# EAGLE design shutter_control (EAGLE 7.3.0)
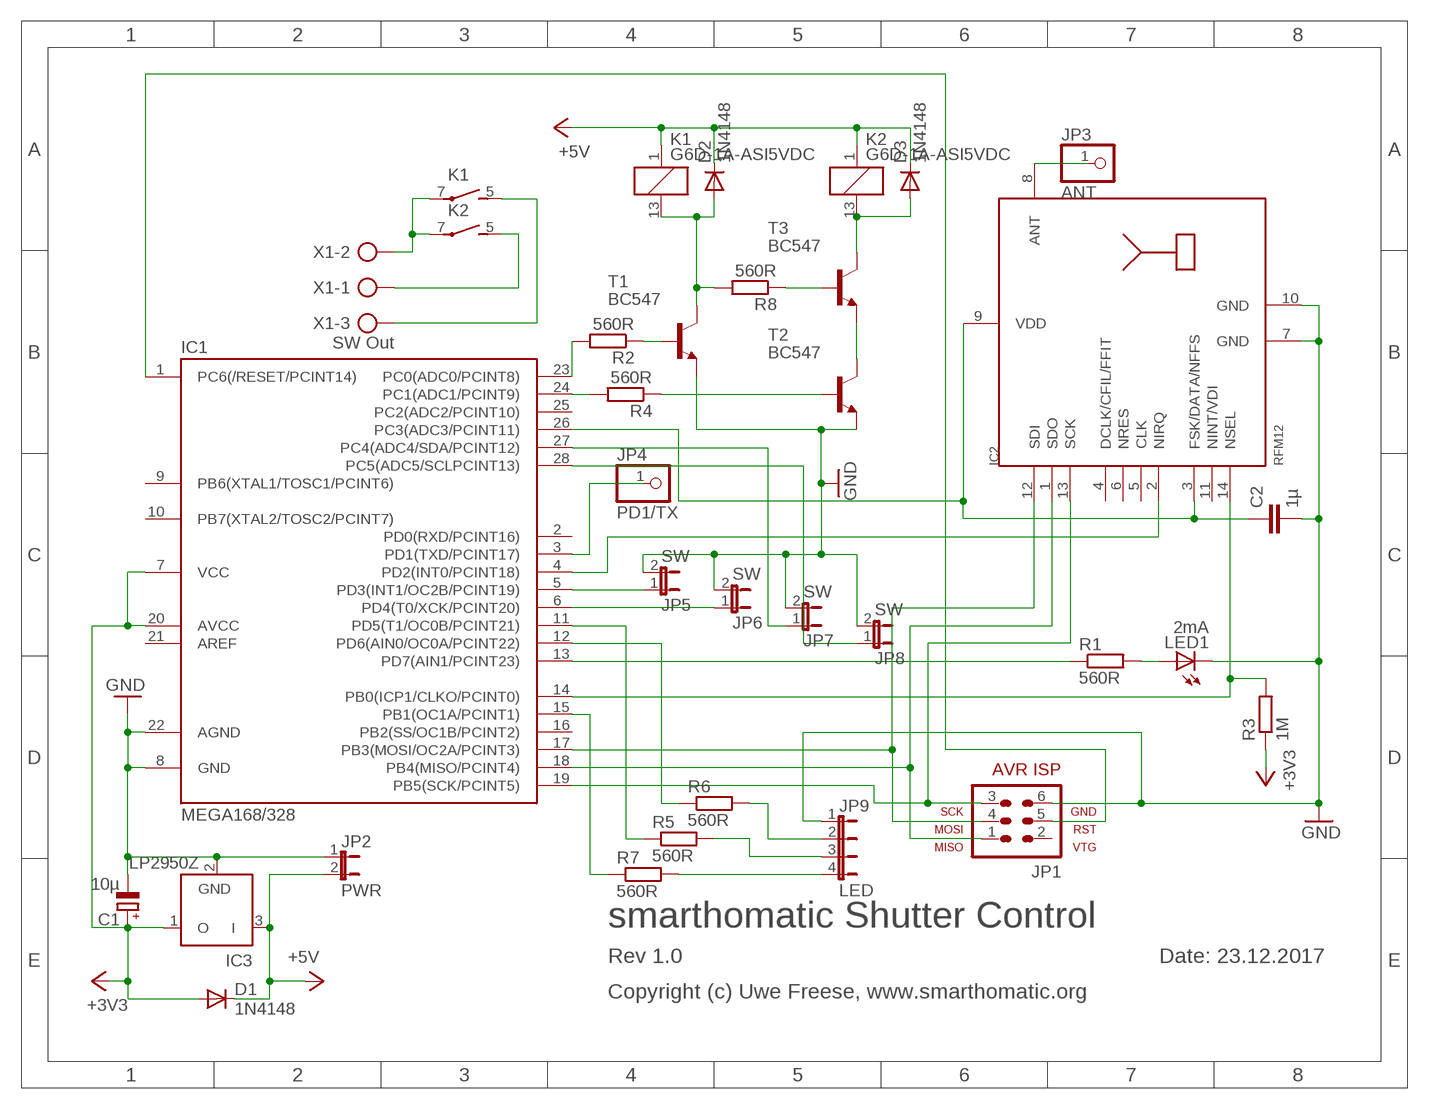
[diagram p0: schematic, sheet 1]

## Parts
C1  10µ  CPOL-EUE1.8-4  [E1,8-4]
C2  1µ  C5/3.5  [C5B3.5]
D1  1N4148  1N4148DO35-7  [DO35-7]
D2  1N4148  1N4148DO35-7  [DO35-7]
D3  1N4148  1N4148DO35-7  [DO35-7]
IC1  MEGA168/328  MEGA48/88/168-PU  [DIL28-3]
IC2  RFM12  [RFM]
IC3  LP2950Z  [TO92]
JP1  AVR-ISP-6  [AVR-ISP-6]
JP2  PWR  JP1E  [JP1]
JP3  ANT  PINHD-1X1  [1X01]
JP4  PD1/TX  PINHD-1X1  [1X01]
JP5  SW  JP1E  [JP1]
JP6  SW  JP1E  [JP1]
JP7  SW  JP1E  [JP1]
JP8  SW  JP1E  [JP1]
JP9  LED  JP4E  [JP4]
K1  G6D-1A-ASI5VDC  [G6D]
K2  G6D-1A-ASI5VDC  [G6D]
LED1  2mA  LED3MM  [LED3MM]
R1  560R  R-EU_0207/7  [0207/7]
R2  560R  R-EU_0207/7  [0207/7]
R3  1M  R-EU_0207/7  [0207/7]
R4  560R  R-EU_0207/7  [0207/7]
R5  560R  R-EU_0207/7  [0207/7]
R6  560R  R-EU_0207/7  [0207/7]
R7  560R  R-EU_0207/7  [0207/7]
R8  560R  R-EU_0207/7  [0207/7]
T1  BC547  [TO92]
T2  BC547  [TO92]
T3  BC547  [TO92]
X1  SW Out  AK500/3  [AK500/3]

## Nets
+3V3: C1.+ D1.A IC1.7(VCC) IC1.20(AVCC) IC3.1(O) R3.1
+5V: D1.C D2.C D3.C IC3.3(I) JP2.2 K1.1 K2.1
GND: C1.- C2.2 IC1.8(GND) IC1.22(AGND) IC2.7(GND) IC2.10(GND) IC3.2(GND) JP1.6 JP2.1 JP5.2 JP6.2 JP7.2 JP8.2 JP9.1 LED1.K(C) T1.1(E) T2.1(E)
N$1: IC1.23(PC0(ADC0/PCINT8)) R2.2
N$3: IC1.17(PB3(MOSI/OC2A/PCINT3)) IC2.12(SDI) JP1.4
N$4: IC1.18(PB4(MISO/PCINT4)) IC2.1(SDO) JP1.1
N$5: IC1.19(PB5(SCK/PCINT5)) IC2.13(SCK) JP1.3
N$6: IC1.13(PD7(AIN1/PCINT23)) R1.1
N$7: R2.1 T1.2(B)
N$8: IC1.1(PC6(/RESET/PCINT14)) JP1.5
N$9: IC1.6(PD4(T0/XCK/PCINT20)) JP6.1
N$10: IC1.5(PD3(INT1/OC2B/PCINT19)) JP5.1
N$11: IC2.8(ANT) JP3.1
N$12: LED1.A R1.2
N$13: IC1.14(PB0(ICP1/CLKO/PCINT0)) IC2.14(NSEL) R3.2
N$14: IC1.24(PC1(ADC1/PCINT9)) R4.2
N$15: IC1.4(PD2(INT0/PCINT18)) IC2.2(NIRQ)
N$16: K1.7(2:P) K2.7(2:P) X1.2
N$17: R4.1 T2.2(B)
N$18: D2.A K1.13 R8.2 T1.3(C)
N$19: D3.A K2.13 T3.3(C)
N$20: IC1.3(PD1(TXD/PCINT17)) JP4.1
N$21: IC1.12(PD6(AIN0/OC0A/PCINT22)) R6.1
N$22: C2.1 IC1.26(PC3(ADC3/PCINT11)) IC2.3(FSK/DATA/NFFS) IC2.9(VDD)
N$23: IC1.11(PD5(T1/OC0B/PCINT21)) R5.1
N$24: IC1.15(PB1(OC1A/PCINT1)) R7.1
N$25: JP9.4 R7.2
N$26: JP9.3 R5.2
N$27: JP9.2 R6.2
N$28: IC1.27(PC4(ADC4/SDA/PCINT12)) JP7.1
N$29: K1.5(2:S) X1.3
N$30: K2.5(2:S) X1.1
N$31: IC1.28(PC5(ADC5/SCLPCINT13)) JP8.1
N$32: T2.3(C) T3.1(E)
N$34: R8.1 T3.2(B)
Unconnected: IC1.2(PD0(RXD/PCINT16)) IC1.9(PB6(XTAL1/TOSC1/PCINT6)) IC1.10(PB7(XTAL2/TOSC2/PCINT7)) IC1.16(PB2(SS/OC1B/PCINT2)) IC1.21(AREF) IC1.25(PC2(ADC2/PCINT10)) IC2.4(DCLK/CFIL/FFIT) IC2.5(CLK) IC2.6(NRES) IC2.11(NINT/VDI) JP1.2

## Notes on the sheet
- smarthomatic Shutter Control
- Rev 1.0 | Date: 23.12.2017
- Copyright (c) Uwe Freese, www.smarthomatic.org

## Library data of the parts
C1 = rcl:CPOL-EU: POLARIZED CAPACITOR, European symbol
C2 = capacitor-wima:C: CAPACITOR naming: grid - package width
D1-D3 = diode:1N4148: DIODE high speed (Philips)
IC1 = avr-5-4.16:MEGA48/88/168-PU
IC2 = hopeRF:RFM12
IC3 = linear:LP2950: 100 mA, Low Power Low Dropout Voltage Regulator Source: http://www.onsemi.com/pub/Collateral/LP2950-D.PDF
JP1 = avr-5-4.16:AVR-ISP-6: AVR ISP-6 Serial Programming Header
JP2 JP5-JP8 = jumper:JP1E: JUMPER
JP3 JP4 = pinhead:PINHD-1X1: PIN HEADER
JP9 = jumper:JP4E: JUMPER
K1 K2 = relay:G6D?*: OMRON Slim, Miniature PCB Relay 17.5 × 6.5 × 12.5 mm with Socked Source: http://ecb.omron.com.sg/pdf/relay/power/G6D.pdf; OC_FARNELL: 9812660; OC_NEWARK: unknown
LED1 = led:LED: LED OSRAM: - CHIPLED LG R971, LG N971, LY N971, LG Q971, LY Q971, LO R971, LY R971 LH N974, LH R974 LS Q976, LO Q976, LY Q976 LO Q996 - Hyper CHIPLED LW Q18S LB Q993, LB Q99A, LB R99A - SideLED LS A670, LO A670, LY A670, LG A670, LP A670 LB A673, LV A673, LT A673, LW A673 LH A674 LY A675 LS A676, LA A676, LO A676, LY A676, LW A676 LS A679, LY A679, LG A679 - Hyper Micro SIDELED® LS Y876, LA Y876, LO Y876, LY Y876 LT Y87S - SmartLED LW L88C, LW L88S LB L89C, LB L89S, LG L890 LS L89K, LO L89K, LY L89K LS L896, LA L896, LO L896, LY L896 - TOPLED LS T670, LO T670, LY T670, LG T670, LP T670 LSG T670, LSP T670, LSY T670, LOP T670, LYG T670 LG T671, LOG T671, LSG T671 LB T673, LV T673, LT T673, LW T673 LH T674 LS T676, LA T676, LO T676, LY T676, LB T676, LH T676, LSB T676, LW T676 LB T67C, LV T67C, LT T67C, LS T67K, LO T67K, LY T67K, LW E67C LS E67B, LA E67B, LO E67B, LY E67B, LB E67C, LV E67C, LT E67C LW T67C LS T679, LY T679, LG T679 LS T770, LO T770, LY T770, LG T770, LP T770 LB T773, LV T773, LT T773, LW T773 LH T774 LS E675, LA E675, LY E675, LS T675 LS T776, LA T776, LO T776, LY T776, LB T776 LHGB T686 LT T68C, LB T68C - Hyper Mini TOPLED® LB M676 - Mini TOPLED Santana® LG M470 LS M47K, LO M47K, LY M47K Source: http://www.osram.convergy.de LUXEON: - LUMILED® LXK2-PW12-R00, LXK2-PW12-S00, LXK2-PW14-U00, LXK2-PW14-V00 LXK2-PM12-R00, LXK2-PM12-S00, LXK2-PM14-U00 LXK2-PE12-Q00, LXK2-PE12-R00, LXK2-PE12-S00, LXK2-PE14-T00, LXK2-PE14-U00 LXK2-PB12-K00, LXK2-PB12-L00, LXK2-PB12-M00, LXK2-PB14-N00, LXK2-PB14-P00, LXK2-PB14-Q00 LXK2-PR12-L00, LXK2-PR12-M00, LXK2-PR14-Q00, LXK2-PR14-R00 LXK2-PD12-Q00, LXK2-PD12-R00, LXK2-PD12-S00 LXK2-PH12-R00, LXK2-PH12-S00 LXK2-PL12-P00, LXK2-PL12-Q00, LXK2-PL12-R00 Source: www.luxeon.com KINGBRIGHT: KA-3528ASYC Source: www.kingbright.com
R1-R8 = rcl:R-EU_: RESISTOR, European symbol
T1-T3 = transistor:BC547: NPN TRANSISTOR
X1 = con-ptr500:AK500/3: CONNECTOR; OC_FARNELL: unknown; OC_NEWARK: unknown

## Net classes
0 default: clearance 0.305 mm

## Board
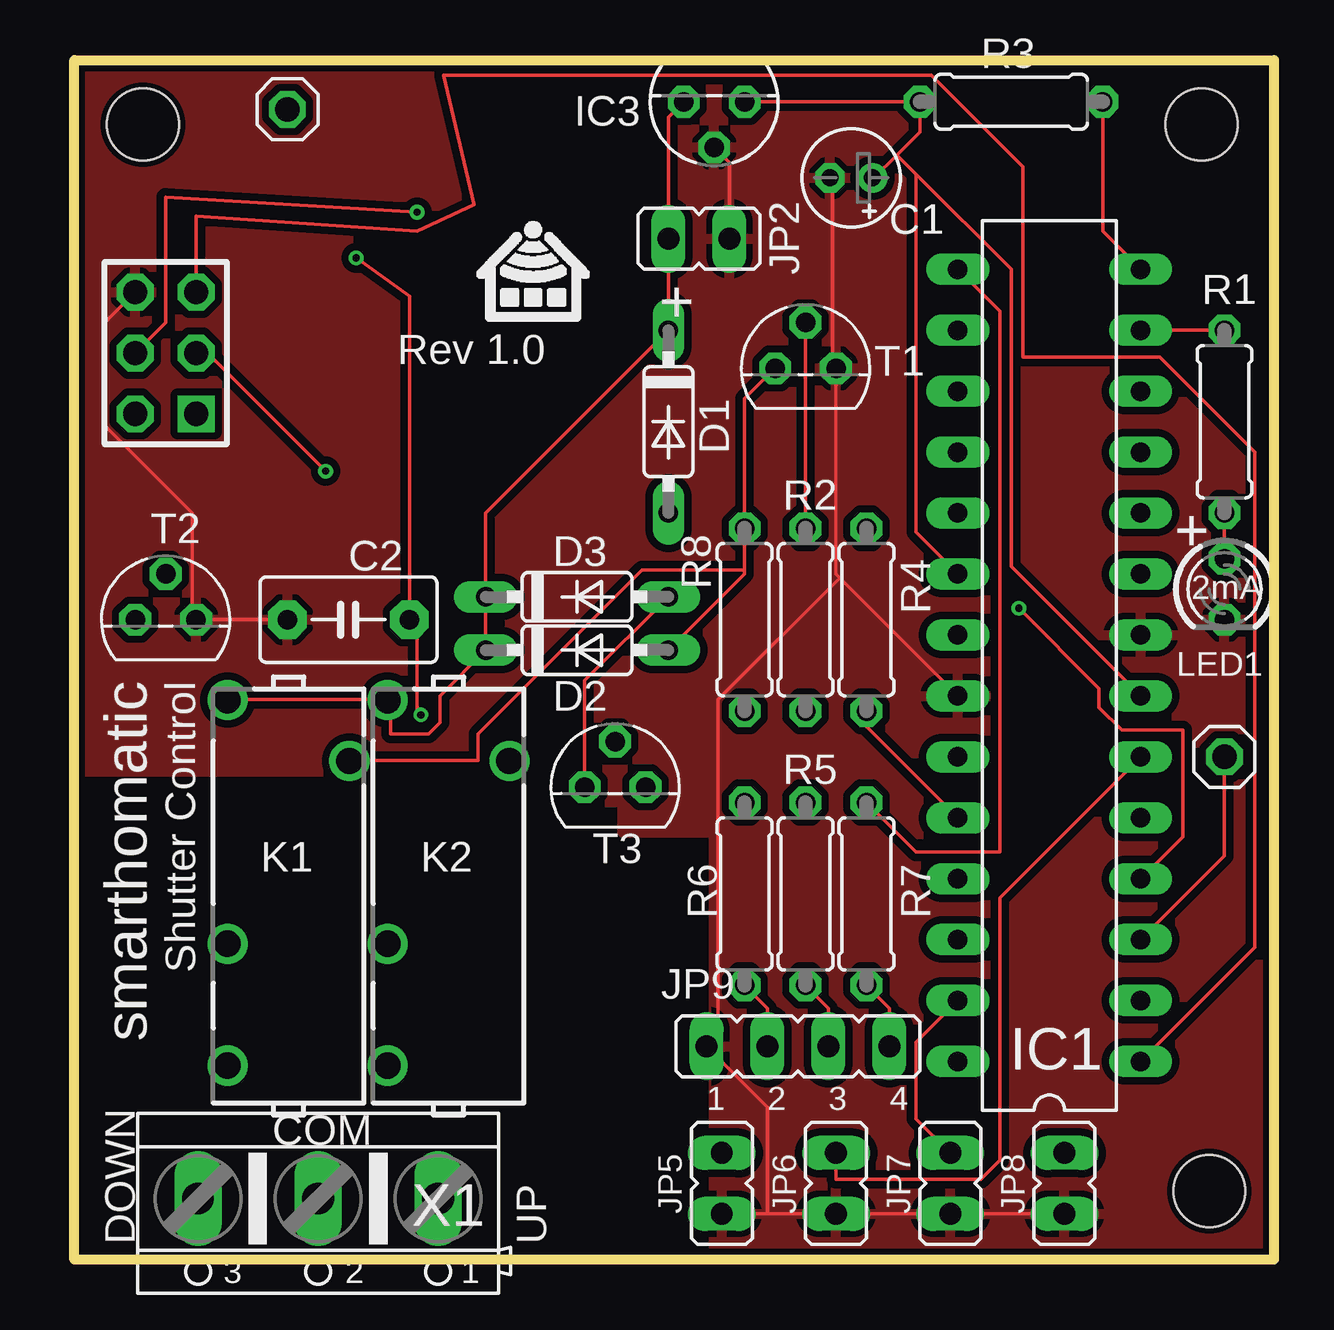
[diagram p1: board, top side]
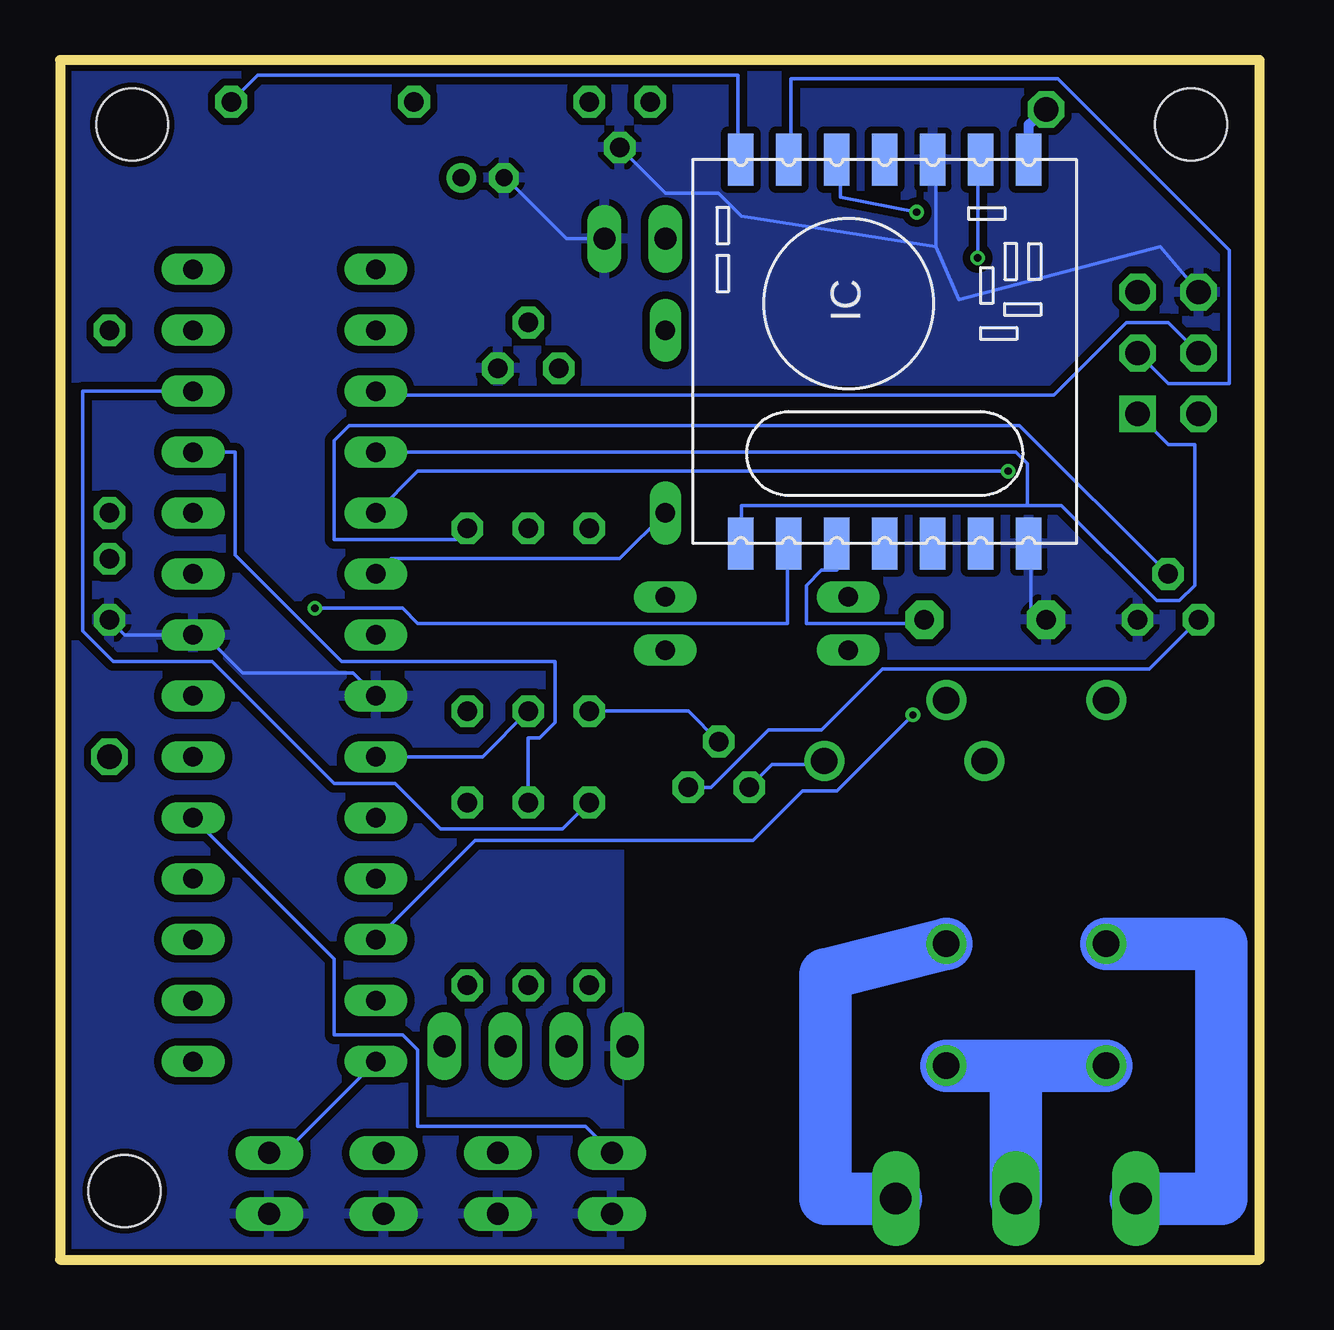
[diagram p2: board, bottom side, seen from below]

Size 50 x 50 mm. Coordinates in mm from the lower left corner, seen from the top.
Outline: 0,0 0,50 50,50 50,0 0,0
Copper layers (1*16): Top 0.035mm / dielectric 1.5mm / Bottom 0.035mm
Design rules "SeeedStudio_2layer_DRU_no_angle_20140221": minimum track width 6mil, minimum drill 12mil, track to track 6mil, track to pad 6mil, pad to pad 6mil, via to via 6mil, smd to smd 0mil, copper to edge 10mil, drill to drill 10mil, minimum pad ring 10mil, minimum via ring 6mil, stop-mask expansion 2mil, vias tented up to drill 100mil, thermal gap 10mil
Holes 3 mm at 2.86,47.31 46.99,47.31 47.31,2.86
tRestrict: area 0,0 to 24.1,19.1
bRestrict: area 0,0 to 24.1,19.1

### Footprints (pad centres in the part's own frame; a part is rotated, then mirrored left to right if it is on the bottom)
E1,8-4 = drill 0.711 pad 1.168: + -0.889,0 | drill 0.711 pad 1.168 octagon: - 0.889,0
C5B3.5 = drill 0.813 pad 1.6 octagon: 1 -2.54,0; 2 2.54,0
DO35-7 = drill 0.813 long: A 3.81,0; C -3.81,0
DIL28-3 = drill 0.813 long: 1 -16.51,-3.81; 2 -13.97,-3.81; 3 -11.43,-3.81; 4 -8.89,-3.81; 5 -6.35,-3.81; 6 -3.81,-3.81; 7 -1.27,-3.81; 8 1.27,-3.81; 9 3.81,-3.81; 10 6.35,-3.81; 11 8.89,-3.81; 12 11.43,-3.81; 13 13.97,-3.81; 14 16.51,-3.81; 15 16.51,3.81; 16 13.97,3.81; 17 11.43,3.81; 18 8.89,3.81; 19 6.35,3.81; 20 3.81,3.81; 21 1.27,3.81; 22 -1.27,3.81; 23 -3.81,3.81; 24 -6.35,3.81; 25 -8.89,3.81; 26 -11.43,3.81; 27 -13.97,3.81; 28 -16.51,3.81
RFM = smd 2.184 x 1.067: 1 0,14; 2 0,12; 3 0,10; 4 0,8; 5 0,6; 6 0,4; 7 0,2; 8 16,2; 9 16,4; 10 16,6; 11 16,8; 12 16,10; 13 16,12; 14 16,14
TO92 = drill 0.813 octagon: 1 -1.27,0; 2 0,1.905; 3 1.27,0
AVR-ISP-6 = drill 1.016 square: 1 -2.54,-1.27 | drill 1.016 octagon: 2 -2.54,1.27; 3 0,-1.27; 4 0,1.27; 5 2.54,-1.27; 6 2.54,1.27
JP1 = drill 0.914 long: 1 0,-1.27; 2 0,1.27
1X01 = drill 1.016 octagon: 1 0,0
JP4 = drill 0.914 long: 1 -3.81,0; 2 -1.27,0; 3 1.27,0; 4 3.81,0
G6D = drill 1.1 pad 1.676: 1 8.08,2.5; 5 -2.08,2.5; 7 -7.16,2.5; 13 5.54,-2.58
LED3MM = drill 0.813 octagon: A -1.27,0; K 1.27,0
0207/7 = drill 0.813 octagon: 1 -3.81,0; 2 3.81,0
TO92' = drill 0.813 octagon: 1 1.27,0; 2 0,1.905; 3 -1.27,0
AK500/3 = drill 1.321 long: 1 -5.004,0; 2 0,0; 3 5.004,0

### Placement (x,y rotation side)
C1  32.38,45.09 180 top
C2  11.43,26.67 180 top
D1  24.77,34.92 270 top
D2  20.95,25.4 0 top
D3  20.95,27.62 0 top
IC1  40.64,24.77 90 top
IC2  7.62,29.84 90 bottom
IC3  26.67,48.26 180 top
JP1  3.81,37.78 90 top
JP2  26.04,42.55 90 top
JP3  8.89,47.94 90 top
JP4  47.94,20.95 90 top
JP5  26.99,3.17 180 top
JP6  31.75,3.17 180 top
JP7  36.51,3.17 180 top
JP8  41.27,3.17 180 top
JP9  30.16,8.89 0 top
K1  8.89,15.24 90 top
K2  15.56,15.24 90 top
LED1  47.94,27.94 270 top
R1  47.94,34.92 270 top
R2  30.48,26.67 270 top
R3  39.05,48.26 0 top
R4  33.02,26.67 270 top
R5  30.48,15.24 270 top
R6  27.94,15.24 270 top
R7  33.02,15.24 270 top
R8  27.94,26.67 90 top
T1  BC547  [TO92']  30.48,37.15 0 top
T2  BC547  [TO92']  3.81,26.67 0 top
T3  BC547  [TO92']  22.54,19.68 0 top
X1  10.16,2.54 180 top

### Tracks (layer width: path | path; a pad name or v marks a point on that pad's centre or on a via)
+3V3
  Top 0.152: 34.29,46.04 35.24,46.99 R3.1 IC3.1 | 34.29,46.04 33.34,45.09 C1.+ | IC1.7 39.05,28.89 39.05,41.27 35.08,45.24 | 34.29,46.04 35.08,45.24 | IC1.20 35.08,30.32 35.08,45.24
  Bottom 0.152: D1.A 26.67,29.21 36.2,29.21 IC1.20
+5V
  Top 0.152: IC3.3 24.77,47.62 JP2.2 D1.C 17.14,31.11 D3.C D2.C 15.24,23.5 15.24,22.38 14.76,21.91 13.18,21.91 13.18,23.18 K2.1 13.02,23.34 6.51,23.34 K1.1
GND
  Top 0.152: 28.89,1.91 JP6.2 JP7.2 JP8.2 | 28.89,1.91 JP5.2 | 28.89,1.91 28.89,6.35 JP9.1 26.83,9.37 26.83,23.34 31.91,28.42 | IC3.2 27.3,45.72 JP2.1 | C1.- 31.59,45.09 31.59,37.31 T1.1 31.75,28.57 31.91,28.42 | C2.2 T2.1 4.92,26.83 4.92,31.11 1.27,34.77 1.27,39.05 JP1.6 | 31.91,28.42 IC1.22
  Bottom 0.152: IC1.22 37.78,24.45 42.39,24.45 43.97,26.04 IC1.8 47.31,26.04 LED1.K | JP2.1 28.89,42.55 31.43,45.09 C1.- | C2.2 9.53,26.67 9.53,29.84 IC2.7 | 13.49,42.23 12.54,40.01 4.13,42.23 JP1.6 | 13.49,42.23 13.49,45.72 IC2.10 | IC3.2 24.77,44.45 22.54,44.45 21.59,43.5 13.49,42.23
  pour Bottom: 0,49.53 49.53,49.53 49.53,0 26.67,0 26.67,17.78 21.59,17.78 21.59,20.32 0,20.32
  pour Top: 0,49.53 49.53,49.53 49.53,0 26.67,0 26.67,17.78 22.86,17.78 22.86,19.05 20.32,19.05 20.32,20.32 0,20.32
N$1
  Bottom 0.152: R2.2 32.38,20.95 IC1.23
N$3  (via drill 0.3)
  Top 0.152: v14.29,43.66 3.81,44.29 3.81,39.05 JP1.4
  Bottom 0.152: v14.29,43.66 17.46,44.29 17.46,45.72 IC2.12 | IC1.17 36.67,36.04 8.57,36.04 5.56,39.05 3.81,39.05 JP1.4
N$4
  Bottom 0.152: 9.68,31.43 8.26,31.43 4.29,27.46 3.33,27.46 2.7,28.1 2.7,33.97 3.81,33.97 JP1.1 | 9.68,31.43 21.59,31.43 21.59,30 IC2.1 | IC1.18 10.16,33.66 9.68,33.18 9.68,31.43
  Bottom 0.406: 21.62,29.21 IC2.1
N$5  (via drill 0.3)
  Top 0.152: v10.48,32.86 5.56,37.78 JP1.3
  Bottom 0.152: JP1.3 3.81,36.51 1.27,36.51 1.27,42.07 8.41,49.21 19.53,49.21 19.53,45.88 IC2.13 | IC1.19 35.08,32.86 v10.48,32.86
N$6
  Top 0.152: R1.1 IC1.13
N$7
  Top 0.152: T1.2 R2.1
N$8
  Top 0.152: IC1.1 49.21,13.02 49.21,33.66 45.24,37.62 39.53,37.62 39.53,45.56 35.72,49.37 15.4,49.37 16.67,43.97 14.29,42.86 5.08,43.5 JP1.5
N$9
  Top 0.152: IC1.6 38.58,15.08 38.58,4.13 37.78,3.33 31.75,3.33 JP6.1
N$10
  Bottom 0.152: IC1.5 38.58,12.54 38.58,9.37 35.72,9.37 35.08,8.73 35.08,5.56 28.1,5.56 JP5.1
N$11
  Bottom 0.406: IC2.8 9.62,47.31 JP3.1
N$12
  Top 0.152: R1.2 LED1.A
N$13
  Top 0.152: IC1.14 42.86,42.86 R3.2
  Bottom 0.152: R3.2 41.75,49.37 21.75,49.37 21.75,45.88 IC2.14
N$14
  Top 0.152: IC1.24 33.02,22.23 R4.2
N$15  (via drill 0.3)
  Top 0.152: v39.37,27.15 42.7,23.81 42.7,23.02 43.66,22.07 46.2,22.07 46.2,17.62 IC1.4
  Bottom 0.152: v39.37,27.15 35.72,27.15 35.08,26.51 19.68,26.51 19.68,29.84 IC2.2
N$16
  Bottom 2.184: X1.2 10.16,8.08 K1.7 K2.7
N$17
  Bottom 0.152: T2.2 10,34.77 37.94,34.77 38.58,34.13 38.58,30 33.5,30 R4.1
N$18
  Top 0.152: D2.A 27.94,28.57 27.94,28.73 | 27.94,28.73 R8.2 27.94,35.88 T1.3 | 27.94,28.73 23.65,28.73 16.83,21.91 16.83,20.8 11.59,20.8 K1.13
N$19
  Top 0.152: D3.A 21.27,24.13 T3.3
  Bottom 0.152: T3.3 20.32,20.64 18.26,20.64 K2.13
N$20
  Top 0.152: IC1.3 47.94,16.83 JP4.1
N$21
  Bottom 0.152: R6.1 29.05,17.94 34.13,17.94 36.04,19.84 38.58,19.84 43.66,24.92 47.78,24.92 49.05,26.19 49.05,36.2 IC1.12
N$22  (via drill 0.3)
  Top 0.152: v11.75,41.75 13.97,40.16 C2.1 14.29,26.35 14.29,22.86 v14.45,22.7
  Bottom 0.152: C2.1 14.13,26.51 18.89,26.51 18.89,28.1 18.26,28.73 17.62,28.73 IC2.3 | v11.75,41.75 11.75,45.72 IC2.9 | IC1.26 32.7,17.46 21.11,17.46 19.05,19.53 17.62,19.53 v14.45,22.7
N$23
  Bottom 0.152: R5.1 30.48,21.75 30,21.75 29.37,22.38 29.37,24.92 38.26,24.92 42.7,29.37 42.7,33.66 IC1.11
N$24
  Top 0.152: R7.1 35.08,16.99 38.58,16.99 38.58,39.53 IC1.15
N$25
  Top 0.152: R7.2 33.97,10.48 JP9.4
N$26
  Top 0.152: R5.2 31.43,10.48 JP9.3
N$27
  Top 0.152: R6.2 28.89,10.48 JP9.2
N$28
  Top 0.152: IC1.27 35.08,9.05 35.08,5.87 JP7.1
N$29
  Bottom 2.184: X1.3 1.59,2.54 1.59,13.16 K1.5
N$30
  Bottom 2.184: K2.5 18.1,11.89 18.1,2.54 X1.1
N$31
  Bottom 0.152: IC1.28 40.64,4.45 JP8.1
N$32
  Bottom 0.152: T2.3 4.6,24.61 15.72,24.61 18.26,22.07 20.48,22.07 22.86,19.68 T3.1
N$34
  Bottom 0.152: T3.2 23.81,22.86 R8.1

### Text on the board
tNames: + | Rev 1.0 | + | 2mA | smarthomatic | Shutter Control | COM | DOWN | UP